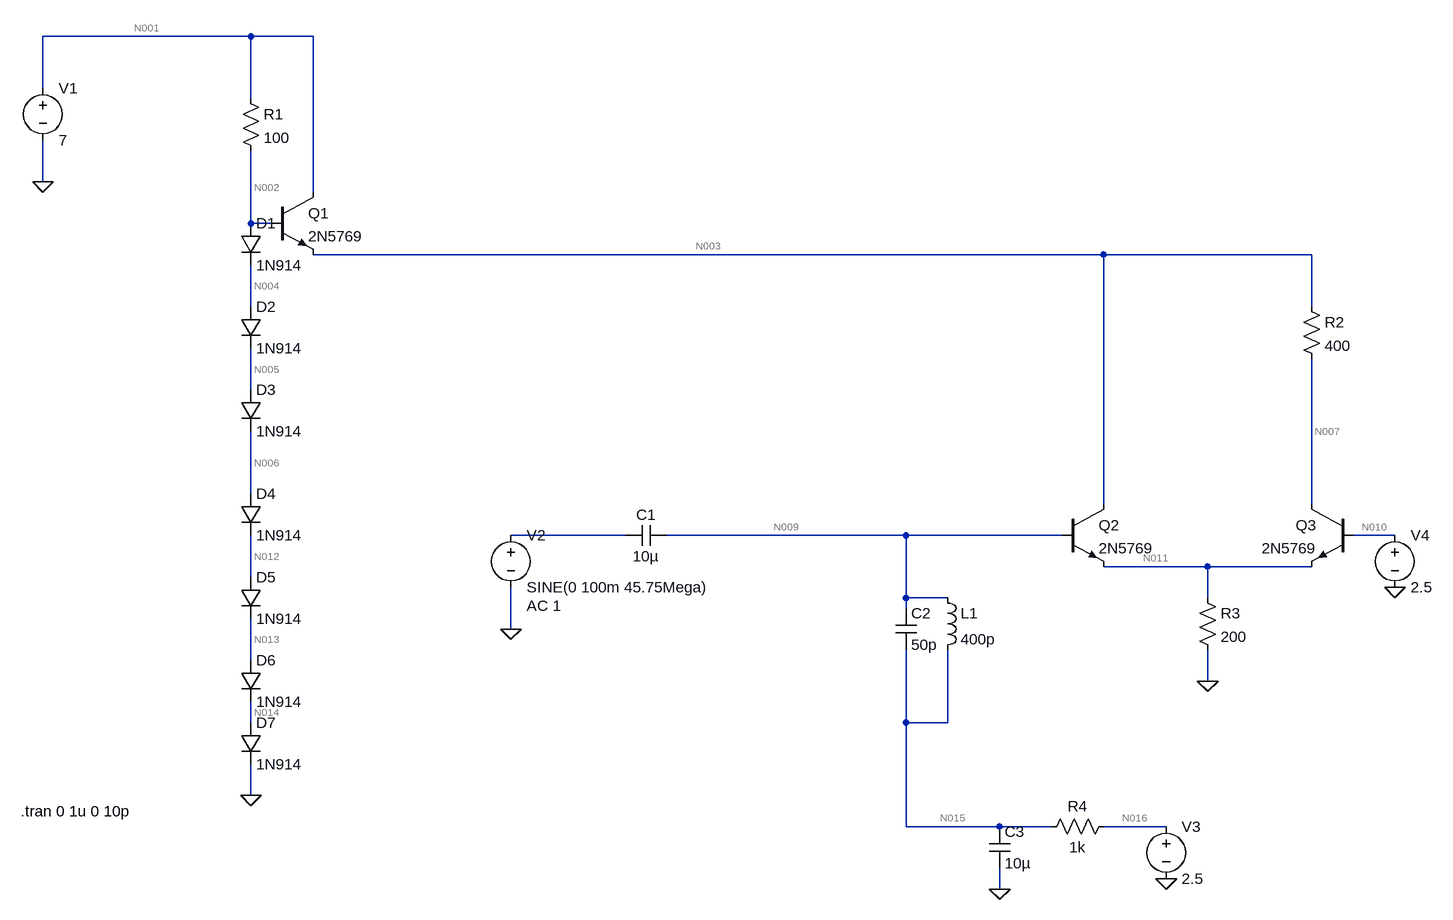
[diagram p0: schematic amp.asc]
amp.asc, the LTspice schematic file:
Version 4
SHEET 1 1856 1140
WIRE 32 -192 -288 -192
WIRE 128 -192 32 -192
WIRE -288 -112 -288 -192
WIRE 32 -96 32 -192
WIRE -288 32 -288 -32
WIRE 128 48 128 -192
WIRE 32 96 32 -16
WIRE 64 96 32 96
WIRE 1344 144 128 144
WIRE 1664 144 1344 144
WIRE 32 224 32 160
WIRE 1664 224 1664 144
WIRE 32 352 32 288
WIRE 32 512 32 416
WIRE 1344 528 1344 144
WIRE 1664 528 1664 304
WIRE 608 576 432 576
WIRE 1040 576 672 576
WIRE 1280 576 1040 576
WIRE 1792 576 1728 576
WIRE 1504 624 1344 624
WIRE 1664 624 1504 624
WIRE 32 640 32 576
WIRE 1040 672 1040 576
WIRE 1104 672 1040 672
WIRE 1504 672 1504 624
WIRE 1040 688 1040 672
WIRE 432 720 432 656
WIRE 32 768 32 704
WIRE 1504 800 1504 752
WIRE 32 864 32 832
WIRE 1040 864 1040 752
WIRE 1104 864 1104 752
WIRE 1104 864 1040 864
WIRE 32 976 32 928
WIRE 1040 1024 1040 864
WIRE 1184 1024 1040 1024
WIRE 1264 1024 1184 1024
WIRE 1440 1024 1344 1024
WIRE 1184 1120 1184 1088
FLAG -288 32 0
FLAG 32 976 0
FLAG 1504 800 0
FLAG 432 720 0
FLAG 1184 1120 0
FLAG 1440 1104 0
FLAG 1792 656 0
SYMBOL voltage -288 -128 R0
WINDOW 123 0 0 Left 0
WINDOW 39 0 0 Left 0
SYMATTR InstName V1
SYMATTR Value 7
SYMBOL npn 64 48 R0
SYMATTR InstName Q1
SYMATTR Value 2N5769
SYMBOL res 16 -112 R0
SYMATTR InstName R1
SYMATTR Value 100
SYMBOL diode 16 96 R0
SYMATTR InstName D1
SYMATTR Value 1N914
SYMBOL diode 16 224 R0
SYMATTR InstName D2
SYMATTR Value 1N914
SYMBOL diode 16 352 R0
SYMATTR InstName D3
SYMATTR Value 1N914
SYMBOL diode 16 640 R0
SYMATTR InstName D5
SYMATTR Value 1N914
SYMBOL diode 16 768 R0
SYMATTR InstName D6
SYMATTR Value 1N914
SYMBOL diode 16 864 R0
SYMATTR InstName D7
SYMATTR Value 1N914
SYMBOL diode 16 512 R0
SYMATTR InstName D4
SYMATTR Value 1N914
SYMBOL npn 1280 528 R0
SYMATTR InstName Q2
SYMATTR Value 2N5769
SYMBOL npn 1728 528 M0
SYMATTR InstName Q3
SYMATTR Value 2N5769
SYMBOL res 1648 208 R0
SYMATTR InstName R2
SYMATTR Value 400
SYMBOL res 1488 656 R0
SYMATTR InstName R3
SYMATTR Value 200
SYMBOL cap 672 560 R90
WINDOW 0 0 32 VBottom 2
WINDOW 3 32 32 VTop 2
SYMATTR InstName C1
SYMATTR Value 10µ
SYMBOL voltage 432 560 R0
WINDOW 123 24 124 Left 2
WINDOW 39 0 0 Left 0
SYMATTR InstName V2
SYMATTR Value SINE(0 100m 45.75Mega)
SYMATTR Value2 AC 1
SYMBOL cap 1024 688 R0
SYMATTR InstName C2
SYMATTR Value 50p
SYMBOL ind 1088 656 R0
SYMATTR InstName L1
SYMATTR Value 400p
SYMBOL cap 1168 1024 R0
SYMATTR InstName C3
SYMATTR Value 10µ
SYMBOL res 1360 1008 R90
WINDOW 0 0 56 VBottom 2
WINDOW 3 32 56 VTop 2
SYMATTR InstName R4
SYMATTR Value 1k
SYMBOL voltage 1440 1008 R0
WINDOW 123 0 0 Left 0
WINDOW 39 0 0 Left 0
SYMATTR InstName V3
SYMATTR Value 2.5
SYMBOL voltage 1792 560 R0
WINDOW 123 0 0 Left 0
WINDOW 39 0 0 Left 0
SYMATTR InstName V4
SYMATTR Value 2.5
TEXT -322 1000 Left 2 !.tran 0 1u 0 10p

The netlist it stands for:
* amp.asc
V1 N001 0 7
Q1 N001 N002 N003 0 2N5769
R1 N001 N002 100
D1 N002 N004 1N914
D2 N004 N005 1N914
D3 N005 N006 1N914
D5 N012 N013 1N914
D6 N013 N014 1N914
D7 N014 0 1N914
D4 N006 N012 1N914
Q2 N003 N009 N011 0 2N5769
Q3 N007 N010 N011 0 2N5769
R2 N003 N007 400
R3 N011 0 200
C1 N009 N008 10µ
V2 N008 0 SINE(0 100m 45.75Mega) AC 1
C2 N009 N015 50p
L1 N009 N015 400p
C3 N015 0 10µ
R4 N016 N015 1k
V3 N016 0 2.5
V4 N010 0 2.5
.model D D
.lib standard.dio
.model NPN NPN
.model PNP PNP
.lib standard.bjt
.tran 0 1u 0 10p
.backanno
.end

* Results of the author's LTspice run, read from the files saved beside the schematic
* Operating Point, zero values left out:
*   V(n001) = 7 V
*   V(n002) = 5.097 V
*   V(n003) = 4.424 V
*   V(n004) = 4.369 V
*   V(n005) = 3.641 V
*   V(n006) = 2.913 V
*   V(n012) = 2.184 V
*   V(n013) = 1.456 V
*   V(n014) = 728.1 mV
*   V(n009) = 2.466 V
*   V(n011) = 1.827 V
*   V(n007) = 2.006 V
*   V(n010) = 2.5 V
*   V(n015) = 2.466 V
*   V(n016) = 2.5 V
*   Ic(Q3) = 6.046 mA
*   Ib(Q3) = 699.4 µA
*   Ie(Q3) = -6.745 mA
*   Ic(Q2) = 2.354 mA
*   Ib(Q2) = 34.48 µA
*   Ie(Q2) = -2.388 mA
*   Ic(Q1) = 8.281 mA
*   Ib(Q1) = 118.2 µA
*   Ie(Q1) = -8.399 mA
*   I(D4) = 18.91 mA
*   I(D7) = 18.91 mA
*   I(D6) = 18.91 mA
*   I(D5) = 18.91 mA
*   I(D3) = 18.91 mA
*   I(D2) = 18.91 mA
*   I(D1) = 18.91 mA
*   I(L1) = -34.48 µA
*   I(R4) = 34.48 µA
*   I(R3) = 9.133 mA
*   I(R2) = 6.046 mA
*   I(R1) = 19.03 mA
*   I(V4) = -699.4 µA
*   I(V3) = -34.48 µA
*   I(V1) = -27.31 mA
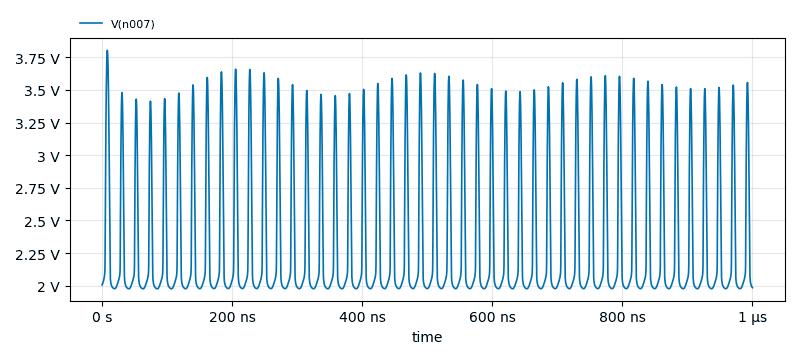
[diagram p1: Transient Analysis of amp.asc, plotted from the saved traces]
* Transient Analysis, 1 run:
*   V(n007): min 1.976 V, max 3.803 V, average 2.324 V, rms 2.385 V, last 1.985 V